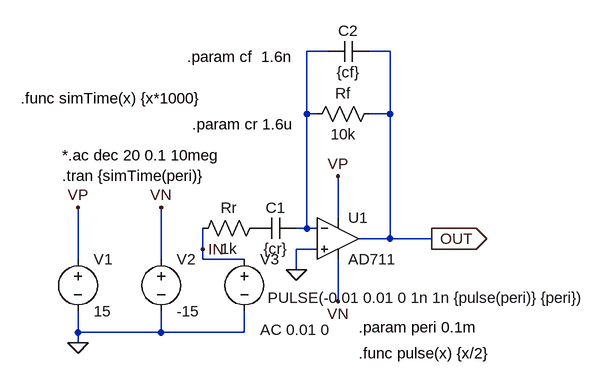
[diagram p0: schematic A2 14step.asc]
A2 14step.asc, the LTspice schematic file:
Version 4
SHEET 1 880 680
WIRE 144 -112 112 -112
WIRE 240 -112 208 -112
WIRE 112 -16 112 -112
WIRE 128 -16 112 -16
WIRE 240 -16 240 -112
WIRE 240 -16 208 -16
WIRE 160 144 160 80
WIRE 112 160 112 -16
WIRE 112 160 96 160
WIRE 128 160 112 160
WIRE 240 176 240 -16
WIRE 240 176 192 176
WIRE 304 176 240 176
WIRE -48 192 -48 160
WIRE 128 192 96 192
WIRE -240 208 -240 128
WIRE -112 208 -112 128
WIRE -48 208 -48 192
WIRE 16 208 -48 208
WIRE 96 224 96 192
WIRE 160 272 160 208
WIRE -240 320 -240 288
WIRE -112 320 -112 288
WIRE -112 320 -240 320
WIRE 16 320 16 288
WIRE 16 320 -112 320
WIRE -240 336 -240 320
FLAG 160 80 VP
FLAG 160 272 VN
FLAG -240 336 0
FLAG -240 128 VP
FLAG -112 128 VN
FLAG 304 176 OUT
IOPIN 304 176 Out
FLAG 96 224 0
FLAG -48 192 IN
SYMBOL OpAmps\\AD711 160 112 R0
SYMATTR InstName U1
SYMBOL voltage -240 192 R0
SYMATTR InstName V1
SYMATTR Value 15
SYMBOL voltage -112 192 R0
SYMATTR InstName V2
SYMATTR Value -15
SYMBOL voltage 16 192 R0
WINDOW 123 24 124 Left 2
WINDOW 39 0 0 Left 0
WINDOW 3 36 75 Left 2
SYMATTR Value2 AC 0.01 0
SYMATTR Value PULSE(-0.01 0.01 0 1n 1n {pulse(peri)} {peri})
SYMATTR InstName V3
SYMBOL res 48 144 R90
WINDOW 0 0 56 VBottom 2
WINDOW 3 32 56 VTop 2
SYMATTR InstName Rr
SYMATTR Value 1k
SYMBOL res 224 -32 R90
WINDOW 0 0 56 VBottom 2
WINDOW 3 32 56 VTop 2
SYMATTR InstName Rf
SYMATTR Value 10k
SYMBOL cap 96 144 R90
WINDOW 0 0 32 VBottom 2
WINDOW 3 32 32 VTop 2
SYMATTR InstName C1
SYMATTR Value {cr}
SYMBOL cap 208 -128 R90
WINDOW 0 0 32 VBottom 2
WINDOW 3 32 32 VTop 2
SYMATTR InstName C2
SYMATTR Value {cf}
TEXT -264 48 Left 2 !*.ac dec 20 0.1 10meg \n.tran {simTime(peri)}
TEXT 192 312 Left 2 !.param peri 0.1m
TEXT -72 -104 Left 2 !.param cf  1.6n
TEXT -64 0 Left 2 !.param cr 1.6u
TEXT 192 352 Left 2 !.func pulse(x) {x/2}
TEXT -328 -40 Left 2 !.func simTime(x) {x*1000}

The netlist it stands for:
* A2 14step.asc
XU1 0 N001 VP VN OUT AD712  ; AD711, pins In+ In- V+ V- OUT
V1 VP 0 15
V2 VN 0 -15
V3 IN 0 PULSE(-0.01 0.01 0 1n 1n {pulse(peri)} {peri}) AC 0.01 0
Rr P001 IN 1k
Rf OUT N001 10k
C1 N001 P001 {cr}
C2 OUT N001 {cf}
*.ac dec 20 0.1 10meg
.tran {simTime(peri)}
.param peri 0.1m
.param cf  1.6n
.param cr 1.6u
.func pulse(x) {x/2}
.func simTime(x) {x*1000}
.lib ADI1.lib
.backanno
.end

* Results of the author's LTspice run, read from the files saved beside the schematic
* Operating Point, zero values left out:
*   V(vp) = 15 V
*   V(out) = 250 nV
*   V(vn) = -15 V
*   V(in) = -10 mV
*   V(p001) = -10 mV
*   I(Rf) = 25 pA
*   I(V2) = 4.899 mA
*   I(V1) = -4.899 mA
*   Ix(u1:1) = 25 pA
*   Ix(u1:2) = 25 pA
*   Ix(u1:3) = 4.899 mA
*   Ix(u1:4) = -4.899 mA
*   Ix(u1:5) = -25 pA